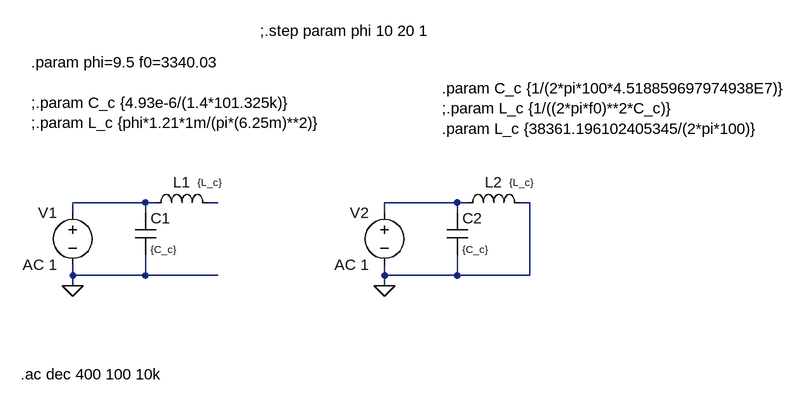
[diagram p0: schematic AC -220722 - Compressor.asc]
AC -220722 - Compressor.asc, the LTspice schematic file:
Version 4
SHEET 1 1196 680
WIRE 128 112 16 112
WIRE 144 112 128 112
WIRE 240 112 224 112
WIRE 608 112 496 112
WIRE 624 112 608 112
WIRE 720 112 704 112
WIRE 16 128 16 112
WIRE 128 128 128 112
WIRE 496 128 496 112
WIRE 608 128 608 112
WIRE 16 224 16 208
WIRE 128 224 128 192
WIRE 128 224 16 224
WIRE 240 224 128 224
WIRE 496 224 496 208
WIRE 608 224 608 192
WIRE 608 224 496 224
WIRE 720 224 720 112
WIRE 720 224 608 224
WIRE 16 240 16 224
WIRE 496 240 496 224
FLAG 16 240 0
FLAG 496 240 0
SYMBOL cap 112 128 R0
WINDOW 3 24 56 Left 1
SYMATTR Value {C_c}
SYMATTR InstName C1
SYMBOL voltage 16 112 M0
SYMATTR InstName V1
SYMATTR Value AC 1
SYMBOL ind 128 128 R270
WINDOW 0 32 56 VTop 2
WINDOW 3 47 80 VRight 1
SYMATTR InstName L1
SYMATTR Value {L_c}
SYMBOL cap 592 128 R0
WINDOW 3 24 56 Left 1
SYMATTR Value {C_c}
SYMATTR InstName C2
SYMBOL voltage 496 112 M0
SYMATTR InstName V2
SYMATTR Value AC 1
SYMBOL ind 608 128 R270
WINDOW 0 32 56 VTop 2
WINDOW 3 47 80 VRight 1
SYMATTR InstName L2
SYMATTR Value {L_c}
TEXT -64 376 Left 2 !.ac dec 400 100 10k
TEXT 304 -152 Left 2 !;.step param phi 10 20 1
TEXT -48 -104 Left 2 !.param phi=9.5 f0=3340.03\n \n;.param C_c {4.93e-6/(1.4*101.325k)}\n;.param L_c {phi*1.21*1m/(pi*(6.25m)**2)}
TEXT 584 -64 Left 2 !.param C_c {1/(2*pi*100*4.518859697974938E7)}\n;.param L_c {1/((2*pi*f0)**2*C_c)}\n.param L_c {38361.196102405345/(2*pi*100)}

The netlist it stands for:
* AC -220722 - Compressor.asc
C1 N001 0 {C_c}
V1 N001 0 AC 1
L1 N001 N002 {L_c}
C2 N003 0 {C_c}
V2 N003 0 AC 1
L2 N003 0 {L_c}
.ac dec 400 100 10k
;.step param phi 10 20 1
.param phi=9.5 f0=3340.03
;.param C_c {4.93e-6/(1.4*101.325k)}
;.param L_c {phi*1.21*1m/(pi*(6.25m)**2)}
.param C_c {1/(2*pi*100*4.518859697974938E7)}
;.param L_c {1/((2*pi*f0)**2*C_c)}
.param L_c {38361.196102405345/(2*pi*100)}
.backanno
.end